# EAGLE design SoilMoisture-V2 (EAGLE 7.6.0)
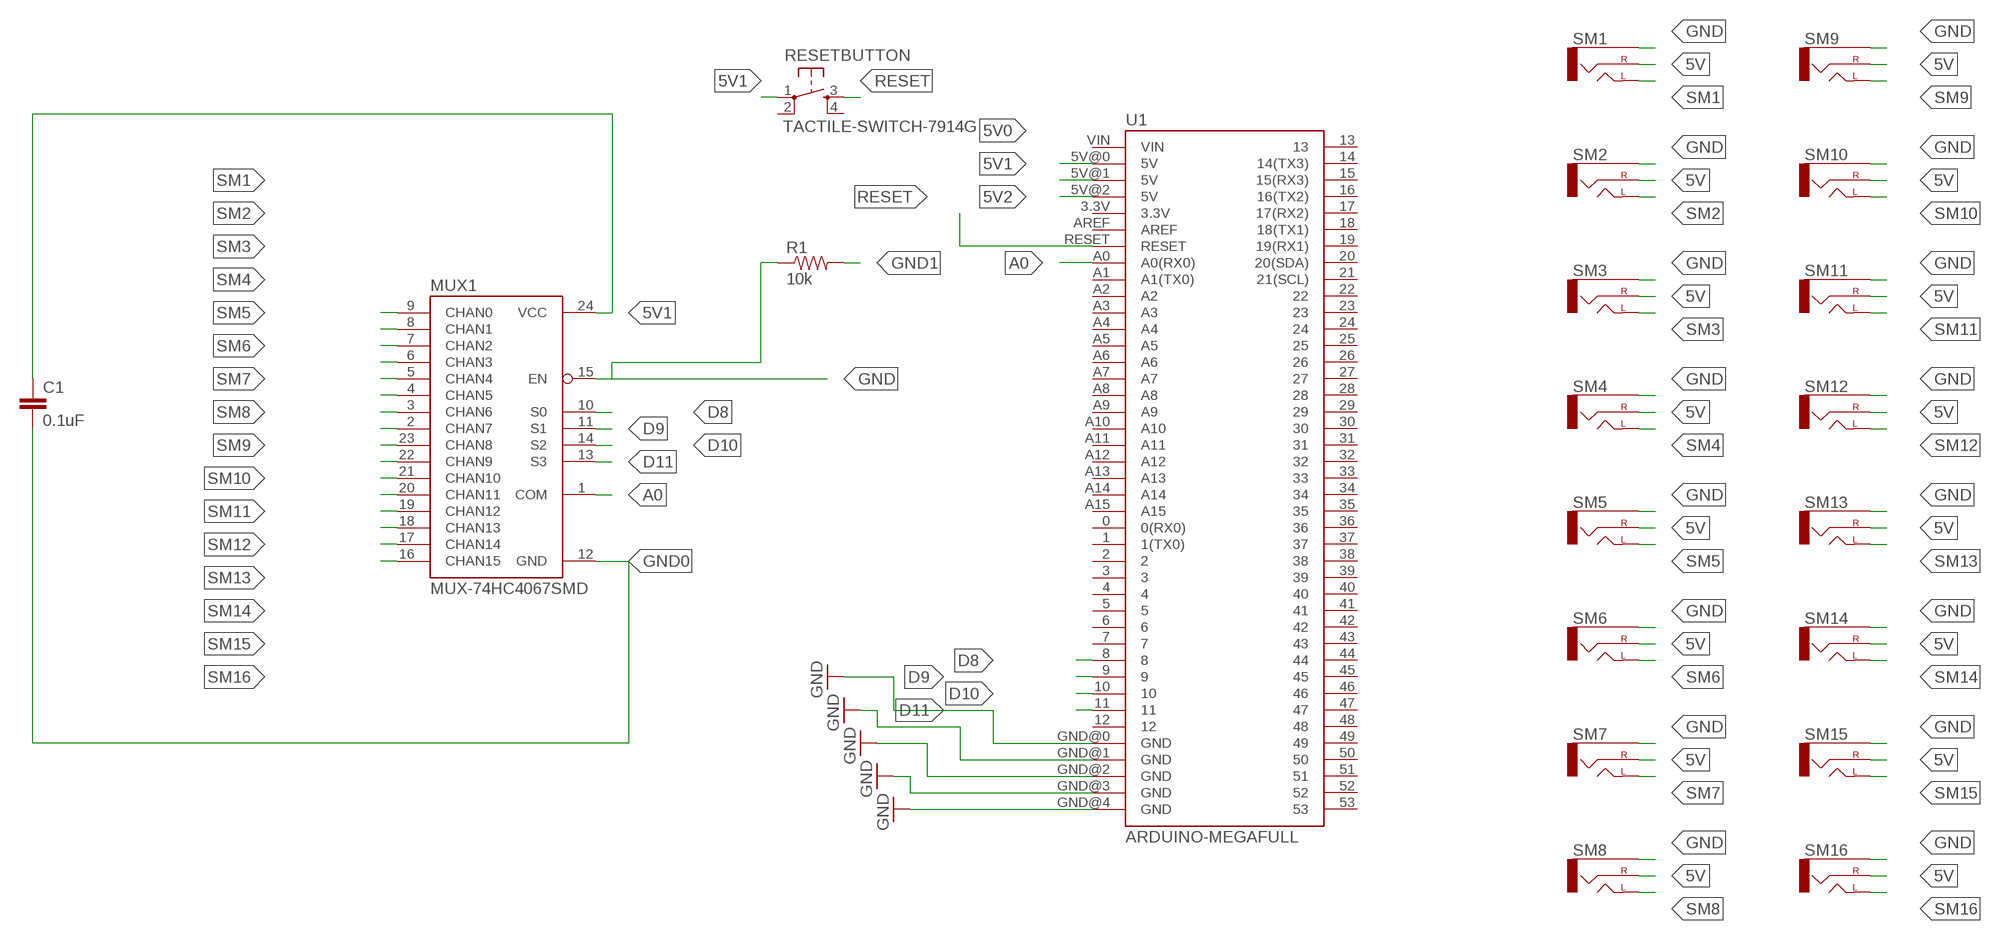
[diagram p0: schematic, sheet 1]

## Parts
C1  0.1uF  0.1UF-25V(+80/-20%)(0603)  [0603-CAP]
MUX1  MUX-74HC4067SMD  [SSOP24]
R1  10k  10K-1%RES-00824  [0402-RES]
RESETBUTTON  TACTILE-SWITCH-7914G  [7914G]
SM1  AUDIO-JACKPTH  [AUDIO-JACK]
SM2  AUDIO-JACKPTH  [AUDIO-JACK]
SM3  AUDIO-JACKPTH  [AUDIO-JACK]
SM4  AUDIO-JACKPTH  [AUDIO-JACK]
SM5  AUDIO-JACKPTH  [AUDIO-JACK]
SM6  AUDIO-JACKPTH  [AUDIO-JACK]
SM7  AUDIO-JACKPTH  [AUDIO-JACK]
SM8  AUDIO-JACKPTH  [AUDIO-JACK]
SM9  AUDIO-JACKPTH  [AUDIO-JACK]
SM10  AUDIO-JACKPTH  [AUDIO-JACK]
SM11  AUDIO-JACKPTH  [AUDIO-JACK]
SM12  AUDIO-JACKPTH  [AUDIO-JACK]
SM13  AUDIO-JACKPTH  [AUDIO-JACK]
SM14  AUDIO-JACKPTH  [AUDIO-JACK]
SM15  AUDIO-JACKPTH  [AUDIO-JACK]
SM16  AUDIO-JACKPTH  [AUDIO-JACK]
U1  ARDUINO-MEGAFULL  [ARDUINO_MEGA]

## Nets
5V: SM1.RING(RIGHT) SM2.RING(RIGHT) SM3.RING(RIGHT) SM4.RING(RIGHT) SM5.RING(RIGHT) SM6.RING(RIGHT) SM7.RING(RIGHT) SM8.RING(RIGHT) SM9.RING(RIGHT) SM10.RING(RIGHT) SM11.RING(RIGHT) SM12.RING(RIGHT) SM13.RING(RIGHT) SM14.RING(RIGHT) SM15.RING(RIGHT) SM16.RING(RIGHT)
5V0: U1.5V@0(5V)
5V1: C1.1 MUX1.24(VCC) RESETBUTTON.1 U1.5V@1(5V)
5V2: U1.5V@2(5V)
A0: MUX1.1(COM) U1.A0(A0(RX0))
D8: MUX1.10(S0) U1.8
D9: MUX1.11(S1) U1.9
D10: MUX1.14(S2) U1.10
D11: MUX1.13(S3) U1.11 U1.GND@2(GND) ; supply symbol labelled GND
GND: MUX1.15(EN) R1.1 SM1.SLEEVE SM2.SLEEVE SM3.SLEEVE SM4.SLEEVE SM5.SLEEVE SM6.SLEEVE SM7.SLEEVE SM8.SLEEVE SM9.SLEEVE SM10.SLEEVE SM11.SLEEVE SM12.SLEEVE SM13.SLEEVE SM14.SLEEVE SM15.SLEEVE SM16.SLEEVE U1.GND@0(GND) U1.GND@1(GND) U1.GND@3(GND) U1.GND@4(GND)
GND0: C1.2 MUX1.12(GND)
GND1: R1.2
RESET: RESETBUTTON.3 U1.RESET
SM1: MUX1.9(CHAN0) SM1.TIP(LEFT)
SM2: MUX1.8(CHAN1) SM2.TIP(LEFT)
SM3: MUX1.7(CHAN2) SM3.TIP(LEFT)
SM4: MUX1.6(CHAN3) SM4.TIP(LEFT)
SM5: MUX1.5(CHAN4) SM5.TIP(LEFT)
SM6: MUX1.4(CHAN5) SM6.TIP(LEFT)
SM7: MUX1.3(CHAN6) SM7.TIP(LEFT)
SM8: MUX1.2(CHAN7) SM8.TIP(LEFT)
SM9: MUX1.23(CHAN8) SM9.TIP(LEFT)
SM10: MUX1.22(CHAN9) SM10.TIP(LEFT)
SM11: MUX1.21(CHAN10) SM11.TIP(LEFT)
SM12: MUX1.20(CHAN11) SM12.TIP(LEFT)
SM13: MUX1.19(CHAN12) SM13.TIP(LEFT)
SM14: MUX1.18(CHAN13) SM14.TIP(LEFT)
SM15: MUX1.17(CHAN14) SM15.TIP(LEFT)
SM16: MUX1.16(CHAN15) SM16.TIP(LEFT)
Unconnected: RESETBUTTON.2 RESETBUTTON.4 U1.0(0(RX0)) U1.1(1(TX0)) U1.2 U1.3 U1.3.3V U1.4 U1.5 U1.6 U1.7 U1.12 U1.13 U1.14(14(TX3)) U1.15(15(RX3)) U1.16(16(TX2)) U1.17(17(RX2)) U1.18(18(TX1)) U1.19(19(RX1)) U1.20(20(SDA)) U1.21(21(SCL)) U1.22 U1.23 U1.24 U1.25 U1.26 U1.27 U1.28 U1.29 U1.30 U1.31 U1.32 U1.33 U1.34 U1.35 U1.36 U1.37 U1.38 U1.39 U1.40 U1.41 U1.42 U1.43 U1.44 U1.45 U1.46 U1.47 U1.48 U1.49 U1.50 U1.51 U1.52 U1.53 U1.A1(A1(TX0)) U1.A2 U1.A3 U1.A4 U1.A5 U1.A6 U1.A7 U1.A8 U1.A9 U1.A10 U1.A11 U1.A12 U1.A13 U1.A14 U1.A15 U1.AREF U1.VIN

## Library data of the parts
C1 = SparkFun-Capacitors:0.1UF-25V(+80/-20%)(0603): CAP-00810 Ceramic Standard decoupling cap; PROD_ID: CAP-00810
MUX1 = SparkFun-AnalogIC:MUX-74HC4067: 16-channel analog MUX; PROD_ID: IC-08252
R1 = SparkFun-Resistors:10K-1%: 10k-ohm SMT 1/10W - 1% (0603) RES-00824; PROD_ID: RES-00824
RESETBUTTON = GeekAmmo:TACTILE-SWITCH: Tactile Switch 4 Pins, SPST NO
SM1-SM16 = SparkFun-Connectors:AUDIO-JACK: 3.5mm Audio Jack Simple 3.5mm common PCB mount audio jack. Variant PTH is our storefront SKU PRT-08032
U1 = SparkFun-Boards:ARDUINO-MEGA: Arduino Mega board footprint

## Board
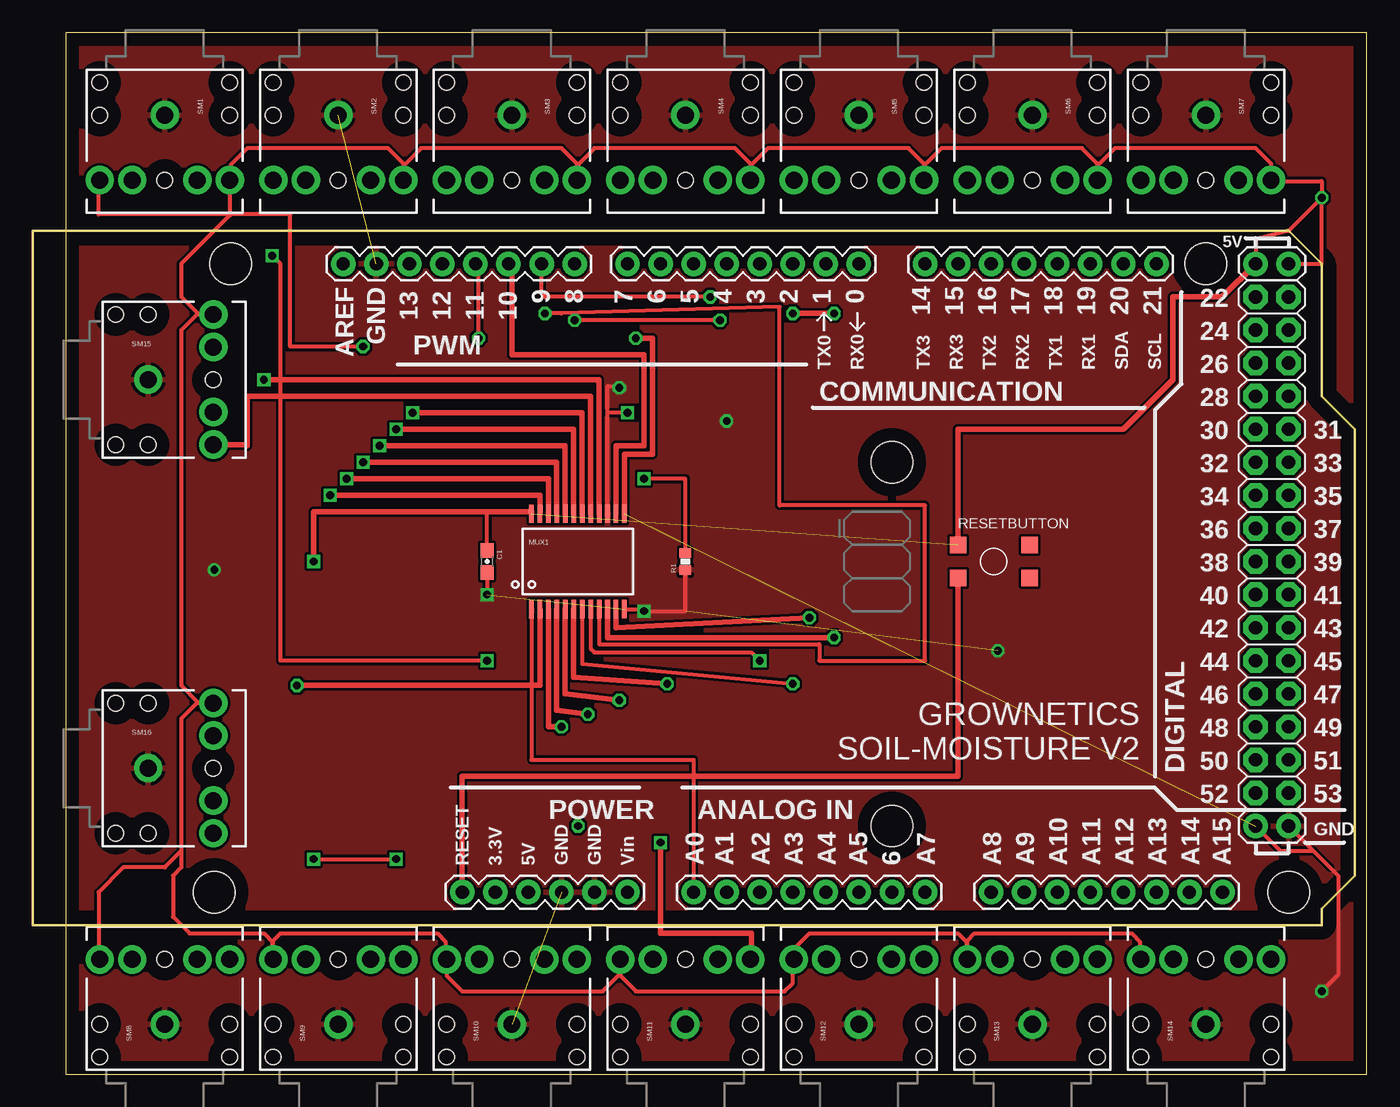
[diagram p1: board, top side]
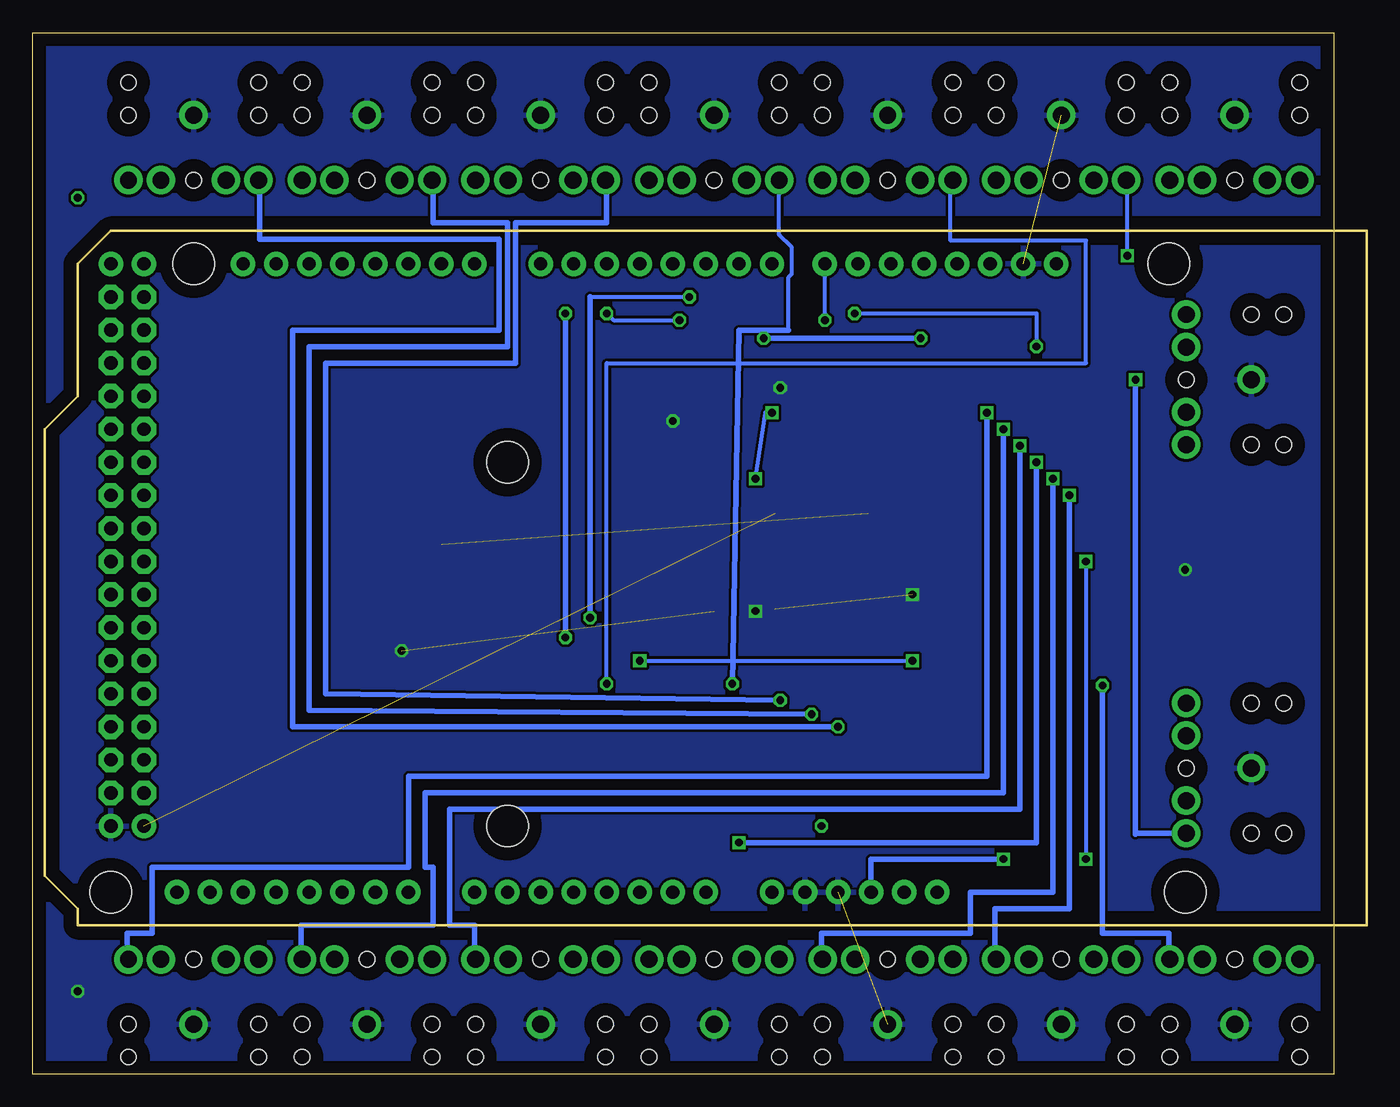
[diagram p2: board, bottom side, seen from below]

Size 100 x 80 mm. Coordinates in mm from the lower left corner, seen from the top.
Outline: 0,0 100,0 100,80 0,80 0,0
Copper layers (1*16): Top 0.035mm / dielectric 1.5mm / Bottom 0.035mm
Design rules "default": minimum track width 10mil, minimum drill 24mil, track to track 8mil, track to pad 8mil, pad to pad 8mil, via to via 8mil, smd to smd 8mil, copper to edge 40mil, drill to drill 8mil, minimum pad ring 10mil, minimum via ring 8mil, stop-mask expansion 4mil, vias tented up to drill 0mil, thermal gap 10mil

### Footprints (pad centres in the part's own frame; a part is rotated, then mirrored left to right if it is on the bottom)
0603-CAP = smd 1.1 x 1: 1 -0.85,0; 2 0.85,0
SSOP24 = smd 0.348 x 1.397: 1 -3.575,-3.656; 2 -2.925,-3.656; 3 -2.275,-3.656; 4 -1.625,-3.656; 5 -0.975,-3.656; 6 -0.325,-3.656; 7 0.325,-3.656; 8 0.975,-3.656; 9 1.625,-3.656; 10 2.275,-3.656; 11 2.925,-3.656; 12 3.575,-3.656; 13 3.575,3.656; 14 2.925,3.656; 15 2.275,3.656; 16 1.625,3.656; 17 0.975,3.656; 18 0.325,3.656; 19 -0.325,3.656; 20 -0.975,3.656; 21 -1.625,3.656; 22 -2.275,3.656; 23 -2.925,3.656; 24 -3.575,3.656
0402-RES = smd 0.7 x 0.9: 1 -0.65,0; 2 0.65,0
7914G = smd 1.27 x 1.27: 1 0,0; 2 0,5.486; 3 2.54,0; 4 2.54,5.486
AUDIO-JACK = drill 1.3 pad 2.184: RING 5,5; RSH 5,2.5; SLEEVE 0,0; TIP 5,-5; TSH 5,-2.5 | hole 1.2: 0,5; -2.5,5; -2.5,-5; 0,-5; 5,0
ARDUINO_MEGA = drill 1.016 pad 1.88: 0 63.5,50.8; 1 60.96,50.8; 2 58.42,50.8; 3 55.88,50.8; 3.3V 35.56,2.54; 4 53.34,50.8; 5 50.8,50.8; 5V@0 38.1,2.54; 5V@1 93.98,50.8; 5V@2 96.52,50.8; 6 48.26,50.8; 7 45.72,50.8; 8 41.656,50.8; 9 39.116,50.8; 10 36.576,50.8; 11 34.036,50.8; 12 31.496,50.8; 13 28.956,50.8; 14 68.58,50.8; 15 71.12,50.8; 16 73.66,50.8; 17 76.2,50.8; 18 78.74,50.8; 19 81.28,50.8; 20 83.82,50.8; 21 86.36,50.8; A0 50.8,2.54; A1 53.34,2.54; A2 55.88,2.54; A3 58.42,2.54; A4 60.96,2.54; A5 63.5,2.54; A6 66.04,2.54; A7 68.58,2.54; A8 73.66,2.54; A9 76.2,2.54; A10 78.74,2.54; A11 81.28,2.54; A12 83.82,2.54; A13 86.36,2.54; A14 88.9,2.54; A15 91.44,2.54; AREF 23.876,50.8; GND@0 40.64,2.54; GND@1 43.18,2.54; GND@2 93.98,7.62; GND@3 96.52,7.62; GND@4 26.416,50.8; RESET 33.02,2.54; VIN 45.72,2.54 | drill 1.016 pad 1.88 octagon: 22 93.98,48.26; 23 96.52,48.26; 24 93.98,45.72; 25 96.52,45.72; 26 93.98,43.18; 27 96.52,43.18; 28 93.98,40.64; 29 96.52,40.64; 30 93.98,38.1; 31 96.52,38.1; 32 93.98,35.56; 33 96.52,35.56; 34 93.98,33.02; 35 96.52,33.02; 36 93.98,30.48; 37 96.52,30.48; 38 93.98,27.94; 39 96.52,27.94; 40 93.98,25.4; 41 96.52,25.4; 42 93.98,22.86; 43 96.52,22.86; 44 93.98,20.32; 45 96.52,20.32; 46 93.98,17.78; 47 96.52,17.78; 48 93.98,15.24; 49 96.52,15.24; 50 93.98,12.7; 51 96.52,12.7; 52 93.98,10.16; 53 96.52,10.16 | hole 3.2: 15.24,50.8; 13.97,2.54; 66.04,35.56; 66.04,7.62; 90.17,50.8; 96.52,2.54

### Placement (x,y rotation side)
C1  32.38,39.37 270 top
MUX1  39.37,39.37 0 top
R1  47.62,39.37 90 top
RESETBUTTON  68.58,40.64 270 top
SM1  7.62,73.66 270 top
SM2  20.95,73.66 270 top
SM3  34.29,73.66 270 top
SM4  47.62,73.66 270 top
SM5  60.96,73.66 270 top
SM6  74.3,73.66 270 top
SM7  87.63,73.66 270 top
SM8  7.62,3.81 90 top
SM9  20.95,3.81 90 top
SM10  34.29,3.81 90 top
SM11  47.62,3.81 90 top
SM12  60.96,3.81 90 top
SM13  74.3,3.81 90 top
SM14  87.63,3.81 90 top
SM15  6.35,53.34 0 top
SM16  6.35,23.5 0 top
U1  -2.54,11.43 0 top

### Tracks (layer width: path | path; a pad name or v marks a point on that pad's centre or on a via)
5V  (via drill 0.6 pad 0.25)
  Top 0.305: 91.44,62.23 91.44,64.14 93.98,64.77 v96.52,67.31 96.52,68.58 92.71,68.58 SM7.RING 92.63,69.93 91.44,71.12 80.64,71.12 79.3,69.77 SM6.RING 79.3,69.93 78.11,71.12 67.31,71.12 66.04,69.85 66.04,68.74 SM5.RING 65.96,69.93 64.77,71.12 53.98,71.12 52.7,69.85 52.7,68.74 SM4.RING 52.62,69.93 51.44,71.12 40.64,71.12 39.37,69.85 39.37,68.74 SM3.RING 39.29,69.93 38.1,71.12 27.3,71.12 26.04,69.85 26.04,68.74 SM2.RING 25.95,69.93 24.77,71.12 13.97,71.12 12.7,69.85 12.7,68.74 SM1.RING 12.62,65.96 8.89,62.23 8.89,59.69 10.16,58.42 11.27,58.42 SM15.RING 10.08,58.34 8.89,57.15 8.89,29.84 10.16,28.57 11.27,28.57 SM16.RING 10.08,28.5 8.89,27.3 8.89,17.14 | 8.89,17.14 7.62,15.88 4.45,15.88 2.54,13.97 2.54,8.89 SM8.RING | 8.89,17.14 8.89,15.88 8.26,15.24 8.26,12.06 9.53,10.79 15.24,10.79 15.88,10.16 15.88,8.89 SM9.RING 15.96,10.24 16.51,10.79 28.57,10.79 29.21,10.16 29.21,8.89 SM10.RING 29.29,7.54 30.48,6.35 41.27,6.35 42.55,7.62 42.55,8.73 SM11.RING 42.62,7.54 43.81,6.35 55.24,6.35 55.88,6.99 55.88,8.73 SM12.RING 55.96,9.61 57.15,10.79 68.58,10.79 69.22,10.16 69.22,8.89 SM13.RING 69.3,10.24 69.85,10.79 81.92,10.79 82.55,10.16 82.55,8.89 SM14.RING
5V1  (via drill 0.6, 0.6 pad 0.25)  (1 unrouted)
  Top 0.305: v19.05,16.51 v25.4,16.51 | C1.1 32.38,43.18
  Top 0.406: RESETBUTTON.1 68.58,49.53 81.28,49.53 85.09,53.34 85.09,59.69 88.9,59.69 U1.5V@1 | MUX1.24 35.8,43.18 32.38,43.18 19.05,43.18 v19.05,39.37
  Bottom 0.305: v19.05,39.37 v19.05,16.51
  Bottom 0.406: v25.4,16.51 35.56,16.51 35.56,13.97
5V2
  Top 0.305: U1.5V@2 96.52,62.23 96.52,66.67
A0
  Top 0.305: 35.8,35.56 35.8,24.13 48.26,24.13 U1.A0
  Top 0.406: MUX1.1 35.8,35.56
D8  (via drill 0.6)
  Top 0.305: v50.29,57.91 v39.12,57.91
  Top 0.406: MUX1.10 41.65,33.53 v59.05,33.53 | v59.05,58.42 v55.88,58.42
  Bottom 0.305: v55.88,58.42 55.37,57.91 v50.29,57.91 | v39.12,57.91 U1.8
  Bottom 0.406: v59.05,33.53 v59.05,58.42 | 39.37,62.23 U1.8
D9  (via drill 0.6)
  Top 0.305: v49.53,59.69 36.83,59.69 36.58,59.94 U1.9
  Top 0.406: MUX1.11 42.3,34.29 v57.15,35.05
  Bottom 0.305: 57.15,59.69 v49.53,59.69
  Bottom 0.406: v57.15,35.05 57.15,59.69 | 36.83,62.23 U1.9
D10
  Top 0.406: MUX1.14 42.3,48.26 44.45,48.26 44.45,55.24 34.29,55.24 34.29,62.23 U1.10
D11  (via drill 0.6)  (1 unrouted)
  Top 0.305: v31.75,56.52 31.75,62.23 U1.11 | U1.GND@2 93.34,17.14 95.89,17.14 97.16,15.88
  Top 0.406: MUX1.13 42.95,47.62 45.09,47.62 45.09,56.52 v43.81,56.52
  Bottom 0.406: v43.81,56.52 v31.75,56.52 | 31.75,62.23 U1.11
GND  (via drill 0.6, 0.6 pad 0.25)  (3 unrouted)
  Top 0.305: U1.GND@3 97.79,15.24 97.79,7.62 v96.52,6.35 | MUX1.15 41.66,43.03 41.66,52.83 42.55,52.83 v42.55,52.7 | v44.45,35.56 47.62,35.56 R1.1
  other vias: 50.8,50.16 32.38,36.83 11.43,38.73 71.63,32.51
  pour Top: -5.08,81.28 101.6,81.28 101.6,25.4 101.6,-3.81 -5.08,-3.81
  pour Top: 0,81.28 101.6,81.28 101.6,-2.54 0,-2.54
  pour Bottom: -1.27,82.55 102.87,82.55 102.87,-3.81 -1.27,-3.81 -1.27,-2.54
GND0  (1 unrouted)
  Top 0.305: C1.2 32.38,36.83 | MUX1.12 44.45,35.71 44.45,35.56
GND1  (via drill 0.6 pad 0.25)
  Top 0.305: R1.2 47.62,45.72 v44.45,45.72 | v43.18,50.8 41.91,50.8
  Bottom 0.305: v44.45,45.72 43.69,50.8 v43.18,50.8
N$1  (via drill 0.6)
  other vias: 25.4,16.51
N$2  (via drill 0.6 pad 0.25)
  other vias: 39.37,19.05
RESET
  Top 0.406: RESETBUTTON.3 68.58,22.86 30.48,22.86 U1.RESET
SM1  (via drill 0.6)
  Top 0.305: MUX1.9 40.99,33.02 57.91,33.02 57.91,31.75 66.04,31.75 66.04,43.69 54.86,43.69 54.86,58.93 38.1,58.42 v36.83,58.42 36.58,58.42 | v22.86,55.88 17.27,55.88 17.27,66.04 2.54,66.04 2.54,68.66 SM1.TIP
  Bottom 0.305: v36.83,58.42 22.86,58.42 v22.86,55.88
SM2  (via drill 0.6 pad 0.25)
  Top 0.305: MUX1.8 40.34,32.68 40.64,32.38 52.7,32.38 v53.34,31.75 | v32.38,31.75 16.51,31.75 16.51,62.23 v15.88,62.87
  Bottom 0.305: v53.34,31.75 v32.38,31.75 | v15.88,62.87 15.88,68.58 SM2.TIP
SM3  (via drill 0.6)
  Top 0.305: MUX1.7 39.7,31.5 v55.88,29.97
  Bottom 0.305: v55.88,29.97 55.88,54.61 19.05,54.61 19.05,64.01 29.46,64.01 29.46,68.66 SM3.TIP
SM4  (via drill 0.6)
  Top 0.406: MUX1.6 39.05,30.48 v46.23,29.97
  Bottom 0.305: 41.91,57.15 41.91,61.21 41.66,61.47 41.66,63.5 42.62,64.47 SM4.TIP
  Bottom 0.406: v46.23,29.97 45.72,57.15 41.91,57.15
SM5  (via drill 0.6)
  Top 0.406: MUX1.5 38.4,29.21 v42.55,28.7
  Bottom 0.406: v42.55,28.7 77.47,29.21 77.47,54.61 62.87,54.61 62.87,65.41 55.88,65.41 55.88,68.66 SM5.TIP
SM6  (via drill 0.6)
  Top 0.406: MUX1.4 37.74,27.94 v40.13,27.64
  Bottom 0.406: v40.13,27.64 78.74,27.94 78.74,55.88 63.5,55.88 63.5,65.41 69.22,65.41 69.22,68.66 SM6.TIP
SM7  (via drill 0.6 pad 0.3)
  Top 0.406: MUX1.3 37.09,26.67 v38.1,26.67
  Bottom 0.406: v38.1,26.67 80.01,26.67 80.01,57.15 64.14,57.15 64.14,64.14 82.55,64.14 82.55,68.66 SM7.TIP
SM8  (via drill 0.6)
  Top 0.406: MUX1.2 36.45,29.84 v17.78,29.84
  Bottom 0.406: v17.78,29.84 17.78,10.79 12.7,10.79 12.7,8.81 SM8.TIP
SM9  (via drill 0.6)
  Top 0.406: MUX1.23 36.45,44.45 v20.32,44.45
  Bottom 0.406: v20.32,44.45 20.32,12.7 26.04,12.7 26.04,8.81 SM9.TIP
SM10  (via drill 0.6)
  Top 0.406: MUX1.22 37.09,45.72 v21.59,45.72
  Bottom 0.406: v21.59,45.72 21.59,13.97 27.94,13.97 27.94,10.79 39.37,10.79 39.37,8.81 SM10.TIP
SM11  (via drill 0.6)
  Top 0.406: MUX1.21 37.74,46.99 v22.86,46.99 | v45.72,17.78 45.72,10.79 52.7,10.79 52.7,8.81 SM11.TIP
  Bottom 0.406: v22.86,46.99 22.86,17.78 v45.72,17.78
SM12  (via drill 0.6)
  Top 0.406: MUX1.20 38.4,48.26 v24.13,48.26
  Bottom 0.406: v24.13,48.26 24.13,20.32 67.94,20.32 67.94,11.43 66.04,11.43 66.04,8.81 SM12.TIP
SM13  (via drill 0.6)
  Top 0.406: MUX1.19 39.05,49.53 v25.4,49.53
  Bottom 0.406: v25.4,49.53 25.4,21.59 69.85,21.59 69.85,15.88 69.22,15.88 69.22,11.43 79.38,11.43 79.38,8.81 SM13.TIP
SM14  (via drill 0.6)
  Top 0.406: MUX1.18 39.7,50.8 v26.67,50.8
  Bottom 0.406: v26.67,50.8 26.67,22.86 71.12,22.86 71.12,15.88 90.81,15.88 90.81,10.79 92.71,10.79 92.71,8.81 SM14.TIP
SM15
  Top 0.406: MUX1.17 40.34,52.07 13.97,52.07 13.97,48.34 | 13.97,48.26 13.97,48.34 | 13.97,48.34 SM15.TIP
SM16  (via drill 0.6)
  Top 0.406: MUX1.16 40.99,53.34 v15.24,53.34
  Bottom 0.406: v15.24,53.34 15.24,18.5 | 15.24,18.41 15.24,18.5 | 15.24,18.5 SM16.TIP

### Text on the board
tPlace: GROWNETICS / SOIL-MOISTURE V2